# EAGLE design schematic (EAGLE 9.6.2)
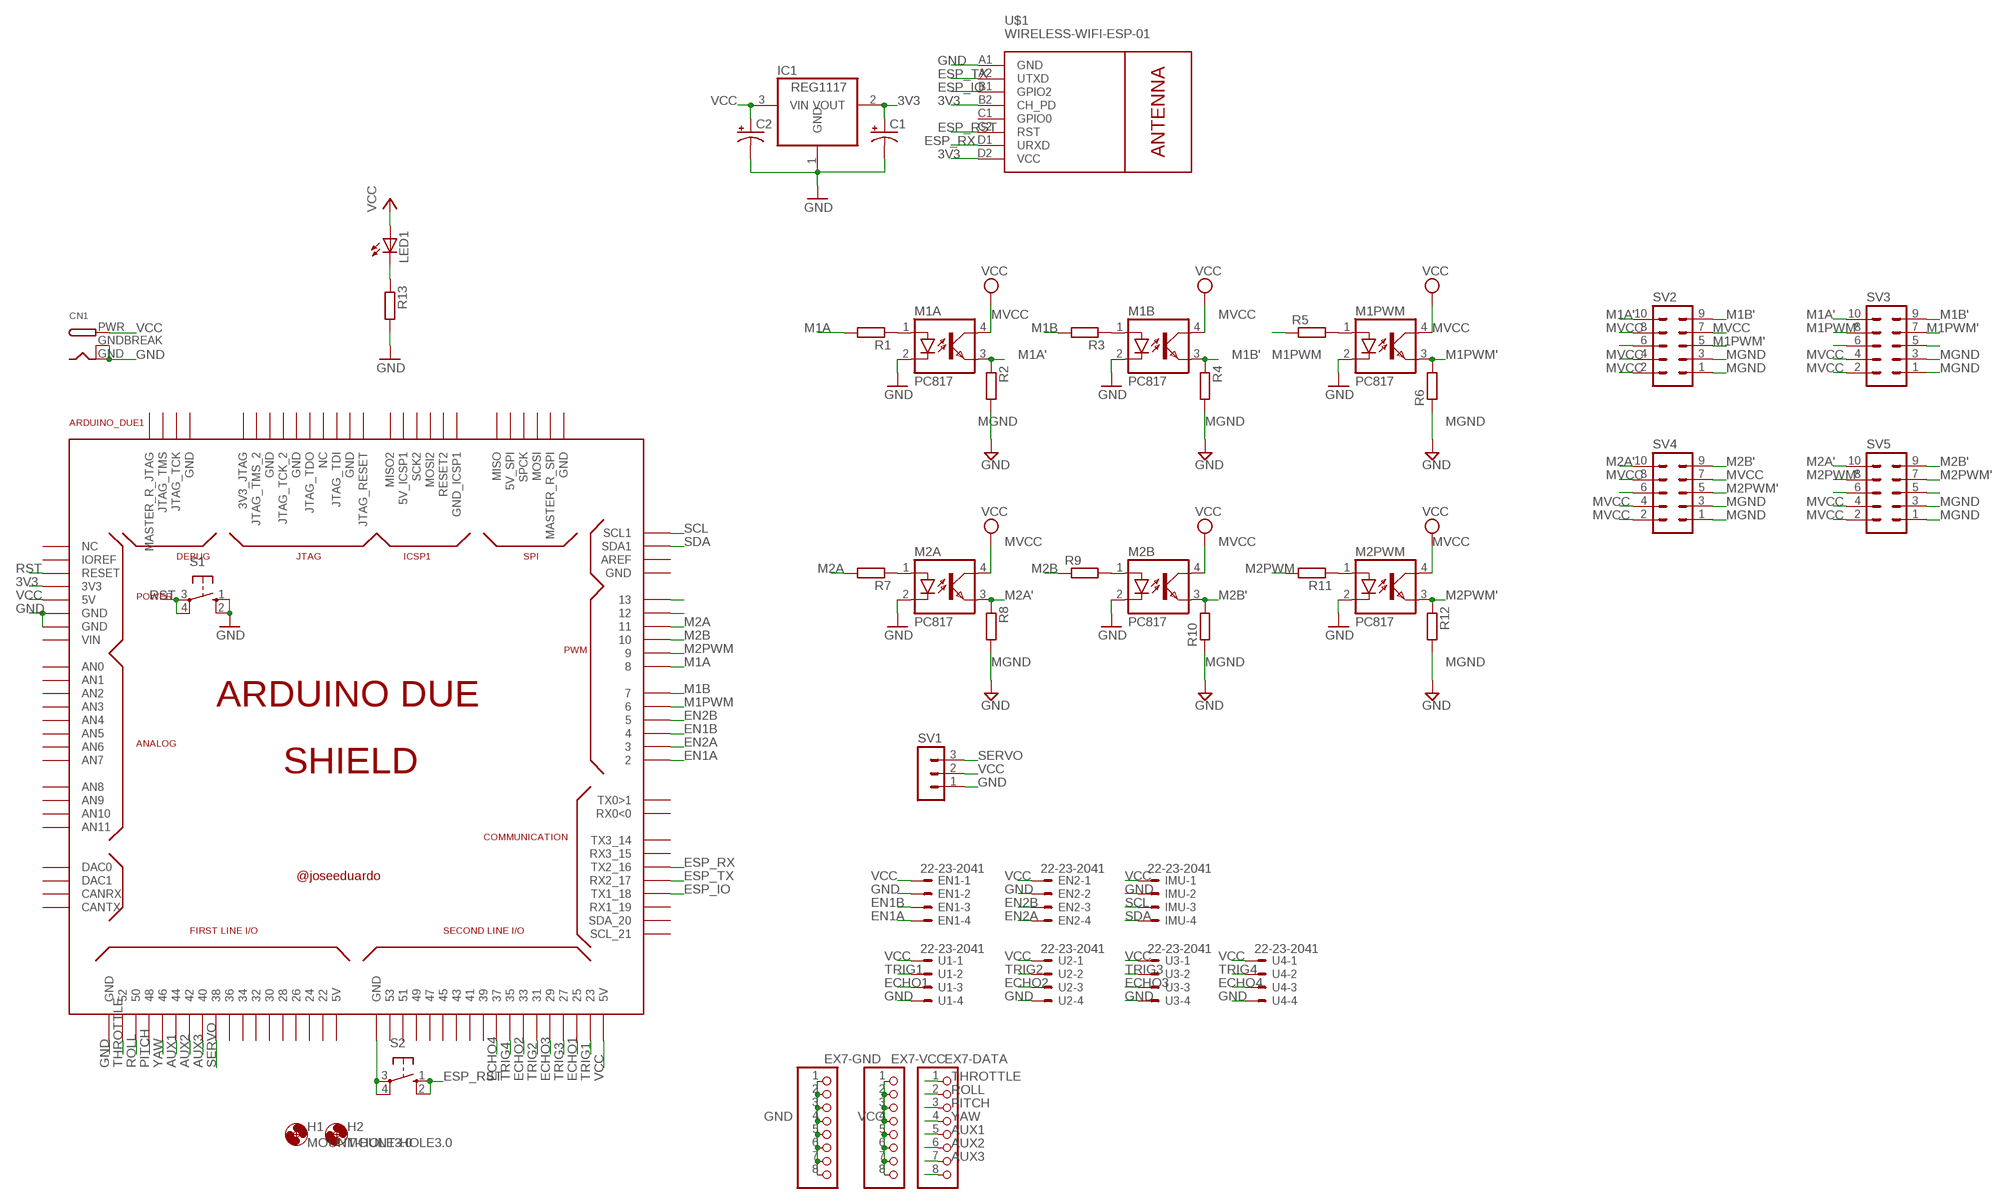
[diagram p0: schematic, sheet 1]

## Parts
ARDUINO_DUE1  ARDUINO_DUE_SHIELD  [ARDUINO_DUE_SHIELD]
C1  CPOL-USTT2D4  [TT2D4]
C2  CPOL-USTT2D4  [TT2D4]
CN1  DCBARRELPTH  [DCJACK_2MM_PTH]
EN1  22-23-2041  [22-23-2041]
EN2  22-23-2041  [22-23-2041]
EX7-DATA  PINHD-1X8BIG  [1X08-BIG]
EX7-GND  PINHD-1X8BIG  [1X08-BIG]
EX7-VCC  PINHD-1X8BIG  [1X08-BIG]
H1  MOUNT-HOLE3.0  [3,0]
H2  MOUNT-HOLE3.0  [3,0]
IC1  REG1117  [SOT223]
IMU  22-23-2041  [22-23-2041]
LED1  LED5MM  [LED5MM]
M1A  PC817  [DIL04]
M1B  PC817  [DIL04]
M1PWM  PC817  [DIL04]
M2A  PC817  [DIL04]
M2B  PC817  [DIL04]
M2PWM  PC817  [DIL04]
R1  R-EU_M0805  [M0805]
R2  R-EU_M0805  [M0805]
R3  R-EU_M0805  [M0805]
R4  R-EU_M0805  [M0805]
R5  R-EU_M0805  [M0805]
R6  R-EU_M0805  [M0805]
R7  R-EU_M0805  [M0805]
R8  R-EU_M0805  [M0805]
R9  R-EU_M0805  [M0805]
R10  R-EU_M0805  [M0805]
R11  R-EU_M0805  [M0805]
R12  R-EU_M0805  [M0805]
R13  R-EU_M0805  [M0805]
S1  40-XX  [B3F-40XX]
S2  40-XX  [B3F-40XX]
SV1  MA03-1  [MA03-1]
SV2  ML10  [ML10]
SV3  ML10  [ML10]
SV4  ML10  [ML10]
SV5  ML10  [ML10]
U1  22-23-2041  [22-23-2041]
U2  22-23-2041  [22-23-2041]
U3  22-23-2041  [22-23-2041]
U4  22-23-2041  [22-23-2041]
U$1  WIRELESS-WIFI-ESP-01  [WIRELESS-WIFI-ESP-01]

## Nets
3V3: ARDUINO_DUE1.3V3 C1.+ IC1.2(VOUT) U$1.B2(CH_PD) U$1.D2(VCC)
AUX1: ARDUINO_DUE1.44 EX7-DATA.5
AUX2: ARDUINO_DUE1.42 EX7-DATA.6
AUX3: ARDUINO_DUE1.40 EX7-DATA.7
ECHO1: ARDUINO_DUE1.25 U1.3
ECHO2: ARDUINO_DUE1.33 U2.3
ECHO3: ARDUINO_DUE1.29 U3.3
ECHO4: ARDUINO_DUE1.37 U4.3
EN1A: ARDUINO_DUE1.2 EN1.4
EN1B: ARDUINO_DUE1.4 EN1.3
EN2A: ARDUINO_DUE1.3 EN2.4
EN2B: ARDUINO_DUE1.5 EN2.3
ESP_IO: ARDUINO_DUE1.18(TX1_18) U$1.B1(GPIO2)
ESP_RST: S2.1(S) S2.2(S1) U$1.C2(RST)
ESP_RX: ARDUINO_DUE1.16(TX2_16) U$1.D1(URXD)
ESP_TX: ARDUINO_DUE1.17(RX2_17) U$1.A2(UTXD)
GND: ARDUINO_DUE1.GND ARDUINO_DUE1.GND_1(GND) ARDUINO_DUE1.GND_2(GND) C1.- C2.- CN1.GND CN1.GNDBREAK EN1.2 EN2.2 EX7-GND.1 EX7-GND.2 EX7-GND.3 EX7-GND.4 EX7-GND.5 EX7-GND.6 EX7-GND.7 EX7-GND.8 IC1.1(GND) IMU.2 M1A.2(C) M1B.2(C) M1PWM.2(C) M2A.2(C) M2B.2(C) M2PWM.2(C) R13.2 S1.1(S) S1.2(S1) SV1.1 U1.4 U2.4 U3.4 U4.4 U$1.A1(GND)
M1A: ARDUINO_DUE1.8 R1.2
M1A': M1A.3(EMIT) R2.1 SV2.10 SV3.10
M1B: ARDUINO_DUE1.7 R3.2
M1B': M1B.3(EMIT) R4.1 SV2.9 SV3.9
M1PWM: ARDUINO_DUE1.6 R5.1
M1PWM': M1PWM.3(EMIT) R6.2 SV2.5 SV3.7 SV3.8
M2A: ARDUINO_DUE1.11 R7.2
M2A': M2A.3(EMIT) R8.1 SV4.10 SV5.10
M2B: ARDUINO_DUE1.10 R9.1
M2B': M2B.3(EMIT) R10.2 SV4.9 SV5.9
M2PWM: ARDUINO_DUE1.9 R11.2
M2PWM': M2PWM.3(EMIT) R12.1 SV4.5 SV5.7 SV5.8
MGND: R2.2 R4.2 R6.1 R8.2 R10.1 R12.2 SV2.1 SV2.3 SV3.1 SV3.3 SV4.1 SV4.3 SV5.1 SV5.3 ; supply symbol labelled GND
MVCC: M1A.4(COL) M1B.4(COL) M1PWM.4(COL) M2A.4(COL) M2B.4(COL) M2PWM.4(COL) SV2.2 SV2.4 SV2.7 SV2.8 SV3.2 SV3.4 SV4.2 SV4.4 SV4.7 SV4.8 SV5.2 SV5.4 ; supply symbol labelled VCC
N$1: M1B.1(A) R3.1
N$2: M1A.1(A) R1.1
N$5: M1PWM.1(A) R5.2
N$6: SV2.6
N$7: M2A.1(A) R7.1
N$8: ARDUINO_DUE1.GND_3(GND) S2.3(P) S2.4(P1)
N$9: M2B.1(A) R9.2
N$10: EX7-DATA.8
N$11: M2PWM.1(A) R11.1
N$13: LED1.K(C) R13.1
N$16: ARDUINO_DUE1.12
N$21: ARDUINO_DUE1.13
N$23: SV3.6
N$28: SV3.5
N$33: SV4.6
N$42: SV5.6
N$48: SV5.5
PITCH: ARDUINO_DUE1.48 EX7-DATA.3
ROLL: ARDUINO_DUE1.50 EX7-DATA.2
RST: ARDUINO_DUE1.RESET S1.3(P) S1.4(P1)
SCL: ARDUINO_DUE1.SCL1 IMU.3
SDA: ARDUINO_DUE1.SDA1 IMU.4
SERVO: ARDUINO_DUE1.38 SV1.3
THROTTLE: ARDUINO_DUE1.52 EX7-DATA.1
TRIG1: ARDUINO_DUE1.23 U1.2
TRIG2: ARDUINO_DUE1.31 U2.2
TRIG3: ARDUINO_DUE1.27 U3.2
TRIG4: ARDUINO_DUE1.35 U4.2
VCC: ARDUINO_DUE1.5V0(5V) ARDUINO_DUE1.5V0_2(5V) C2.+ CN1.PWR EN1.1 EN2.1 EX7-VCC.1 EX7-VCC.2 EX7-VCC.3 EX7-VCC.4 EX7-VCC.5 EX7-VCC.6 EX7-VCC.7 EX7-VCC.8 IC1.3(VIN) IMU.1 LED1.A SV1.2 U1.1 U2.1 U3.1 U4.1
YAW: ARDUINO_DUE1.46 EX7-DATA.4
Unconnected: ARDUINO_DUE1.0(RX0<0) ARDUINO_DUE1.1(TX0>1) ARDUINO_DUE1.3V3_JTAG ARDUINO_DUE1.5V0_1(5V) ARDUINO_DUE1.5V_2(5V_SPI) ARDUINO_DUE1.5V_ICSP1 ARDUINO_DUE1.14(TX3_14) ARDUINO_DUE1.15(RX3_15) ARDUINO_DUE1.19(RX1_19) ARDUINO_DUE1.20(SDA_20) ARDUINO_DUE1.21(SCL_21) ARDUINO_DUE1.22 ARDUINO_DUE1.24 ARDUINO_DUE1.26 ARDUINO_DUE1.28 ARDUINO_DUE1.30 ARDUINO_DUE1.32 ARDUINO_DUE1.34 ARDUINO_DUE1.36 ARDUINO_DUE1.39 ARDUINO_DUE1.41 ARDUINO_DUE1.43 ARDUINO_DUE1.45 ARDUINO_DUE1.47 ARDUINO_DUE1.49 ARDUINO_DUE1.51 ARDUINO_DUE1.53 ARDUINO_DUE1.A0(AN0) ARDUINO_DUE1.A1(AN1) ARDUINO_DUE1.A2(AN2) ARDUINO_DUE1.A3(AN3) ARDUINO_DUE1.A4(AN4) ARDUINO_DUE1.A5(AN5) ARDUINO_DUE1.A6(AN6) ARDUINO_DUE1.A7(AN7) ARDUINO_DUE1.A8(AN8) ARDUINO_DUE1.A9(AN9) ARDUINO_DUE1.A10(AN10) ARDUINO_DUE1.A11(AN11) ARDUINO_DUE1.AREF ARDUINO_DUE1.CANRX ARDUINO_DUE1.CANTX ARDUINO_DUE1.DAC0 ARDUINO_DUE1.DAC1 ARDUINO_DUE1.GND_4(GND) ARDUINO_DUE1.GND_5(GND) ARDUINO_DUE1.GND_7(GND) ARDUINO_DUE1.GND_8(GND) ARDUINO_DUE1.GND_9(GND) ARDUINO_DUE1.GND_10(GND) ARDUINO_DUE1.GND_ICSP1 ARDUINO_DUE1.IOREF ARDUINO_DUE1.JTAG_RESET ARDUINO_DUE1.JTAG_TCK ARDUINO_DUE1.JTAG_TCK_2 ARDUINO_DUE1.JTAG_TDI ARDUINO_DUE1.JTAG_TDO ARDUINO_DUE1.JTAG_TMS ARDUINO_DUE1.JTAG_TMS_2 ARDUINO_DUE1.MASTER_RESET_JTAG(MASTER_R_JTAG) ARDUINO_DUE1.MASTER_RESET_SPI(MASTER_R_SPI) ARDUINO_DUE1.MISO ARDUINO_DUE1.MISO2 ARDUINO_DUE1.MOSI ARDUINO_DUE1.MOSI2 ARDUINO_DUE1.NC_2(NC) ARDUINO_DUE1.NC_5(NC) ARDUINO_DUE1.RESET2 ARDUINO_DUE1.SCK2 ARDUINO_DUE1.SPCK ARDUINO_DUE1.VIN U$1.C1(GPIO0)

## Library data of the parts
ARDUINO_DUE1 = arduino_due_shield:ARDUINO_DUE_SHIELD
C1 C2 = adafruit:CPOL-US: POLARIZED CAPACITOR, American symbol
CN1 = adafruit:DCBARREL: 2.0mm DC Barrel Jack DCJACK_2MM_PTH - Through Hole Jack (4UConnector: 05537)
EN1 EN2 IMU U1-U4 = con-molex:22-23-2041: .100" (2.54mm) Center Header - 4 Pin; MF: MOLEX; MPN: 22-23-2041; OC_FARNELL: 1462920; OC_NEWARK: 38C0355
EX7-DATA EX7-GND EX7-VCC = adafruit:PINHD-1X8: PIN HEADER
H1 H2 = holes:MOUNT-HOLE: MOUNTING HOLE with drill center marker
IC1 = burr-brown:REG1117: 800mA and 1A Low Dropout (LDO) Positive Regulator 1.8V, 2.5V, 2.85V, 3.3V, 5V, and Adj; MPN: REG1117; OC_FARNELL: 1097566; OC_NEWARK: 14P6981
LED1 = adafruit:LED: LED OSRAM: - CHIPLED LG R971, LG N971, LY N971, LG Q971, LY Q971, LO R971, LY R971 LH N974, LH R974 LS Q976, LO Q976, LY Q976 LO Q996 - Hyper CHIPLED LW Q18S LB Q993, LB Q99A, LB R99A - SideLED LS A670, LO A670, LY A670, LG A670, LP A670 LB A673, LV A673, LT A673, LW A673 LH A674 LY A675 LS A676, LA A676, LO A676, LY A676, LW A676 LS A679, LY A679, LG A679 - Hyper Micro SIDELED® LS Y876, LA Y876, LO Y876, LY Y876 LT Y87S - SmartLED LW L88C, LW L88S LB L89C, LB L89S, LG L890 LS L89K, LO L89K, LY L89K LS L896, LA L896, LO L896, LY L896 - TOPLED LS T670, LO T670, LY T670, LG T670, LP T670 LSG T670, LSP T670, LSY T670, LOP T670, LYG T670 LG T671, LOG T671, LSG T671 LB T673, LV T673, LT T673, LW T673 LH T674 LS T676, LA T676, LO T676, LY T676, LB T676, LH T676, LSB T676, LW T676 LB T67C, LV T67C, LT T67C, LS T67K, LO T67K, LY T67K, LW E67C LS E67B, LA E67B, LO E67B, LY E67B, LB E67C, LV E67C, LT E67C LW T67C LS T679, LY T679, LG T679 LS T770, LO T770, LY T770, LG T770, LP T770 LB T773, LV T773, LT T773, LW T773 LH T774 LS E675, LA E675, LY E675, LS T675 LS T776, LA T776, LO T776, LY T776, LB T776 LHGB T686 LT T68C, LB T68C - Hyper Mini TOPLED® LB M676 - Mini TOPLED Santana® LG M470 LS M47K, LO M47K, LY M47K Source: http://www.osram.convergy.de/
M1A M1B M1PWM M2A M2B M2PWM = optocoupler:PC817: SHARP OPTO COUPLER; MPN: PC817X4J000F; OC_FARNELL: 9707727; OC_NEWARK: 97K7059
R1-R13 = rcl:R-EU_: RESISTOR, European symbol; SPICEPREFIX: R
S1 S2 = adafruit:40-XX: OMRON SWITCH; MF: OMRON COMPONENTS USA; MPN: B3F-4000; OC_FARNELL: 176434; OC_NEWARK: 36K3105
SV1 = con-lstb:MA03-1: PIN HEADER; OC_FARNELL: unknown; OC_NEWARK: unknown
SV2-SV5 = con-ml:ML10: HARTING; OC_FARNELL: unknown; OC_NEWARK: unknown
U$1 = ESP-01:WIRELESS-WIFI-ESP-01: Wireless Wi-Fi ESP-01 Module based on ESP8266 chip Click here to find device on ebay.com <http://www.ebay.com/sch/esp8266+esp+01+transceiver>

## Board
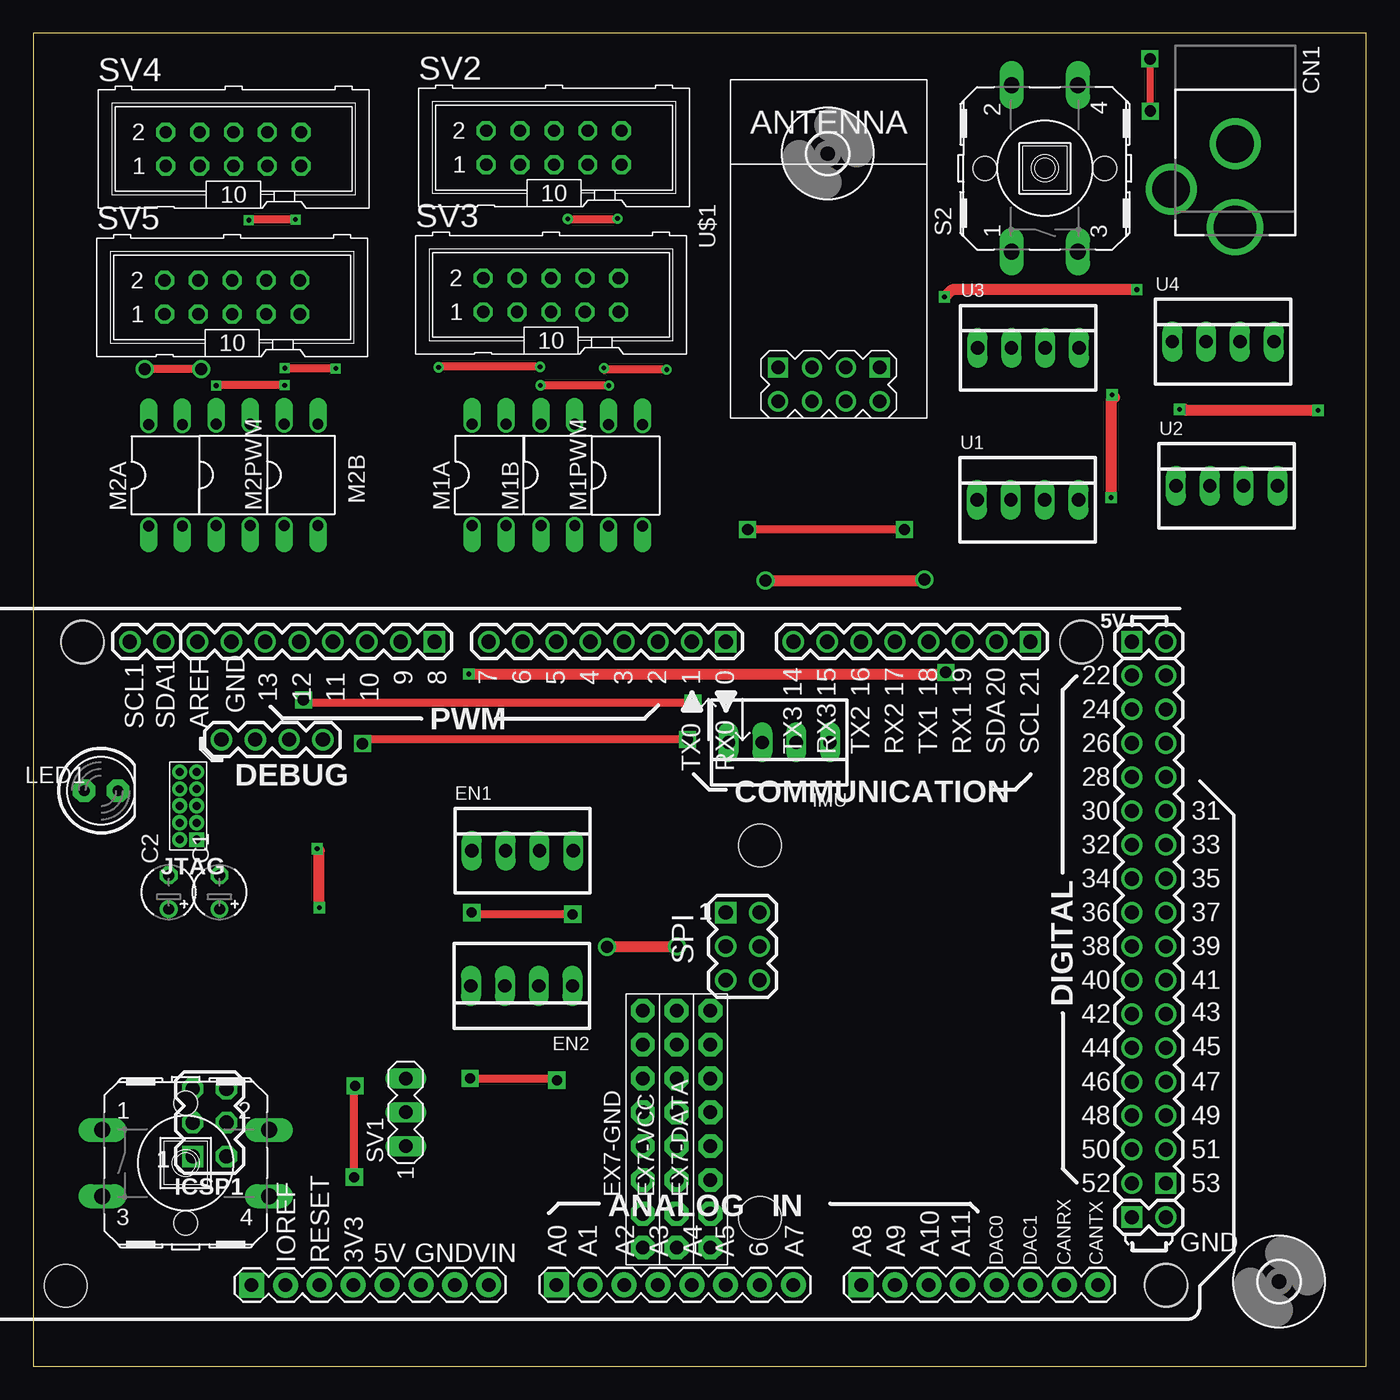
[diagram p1: board, top side]
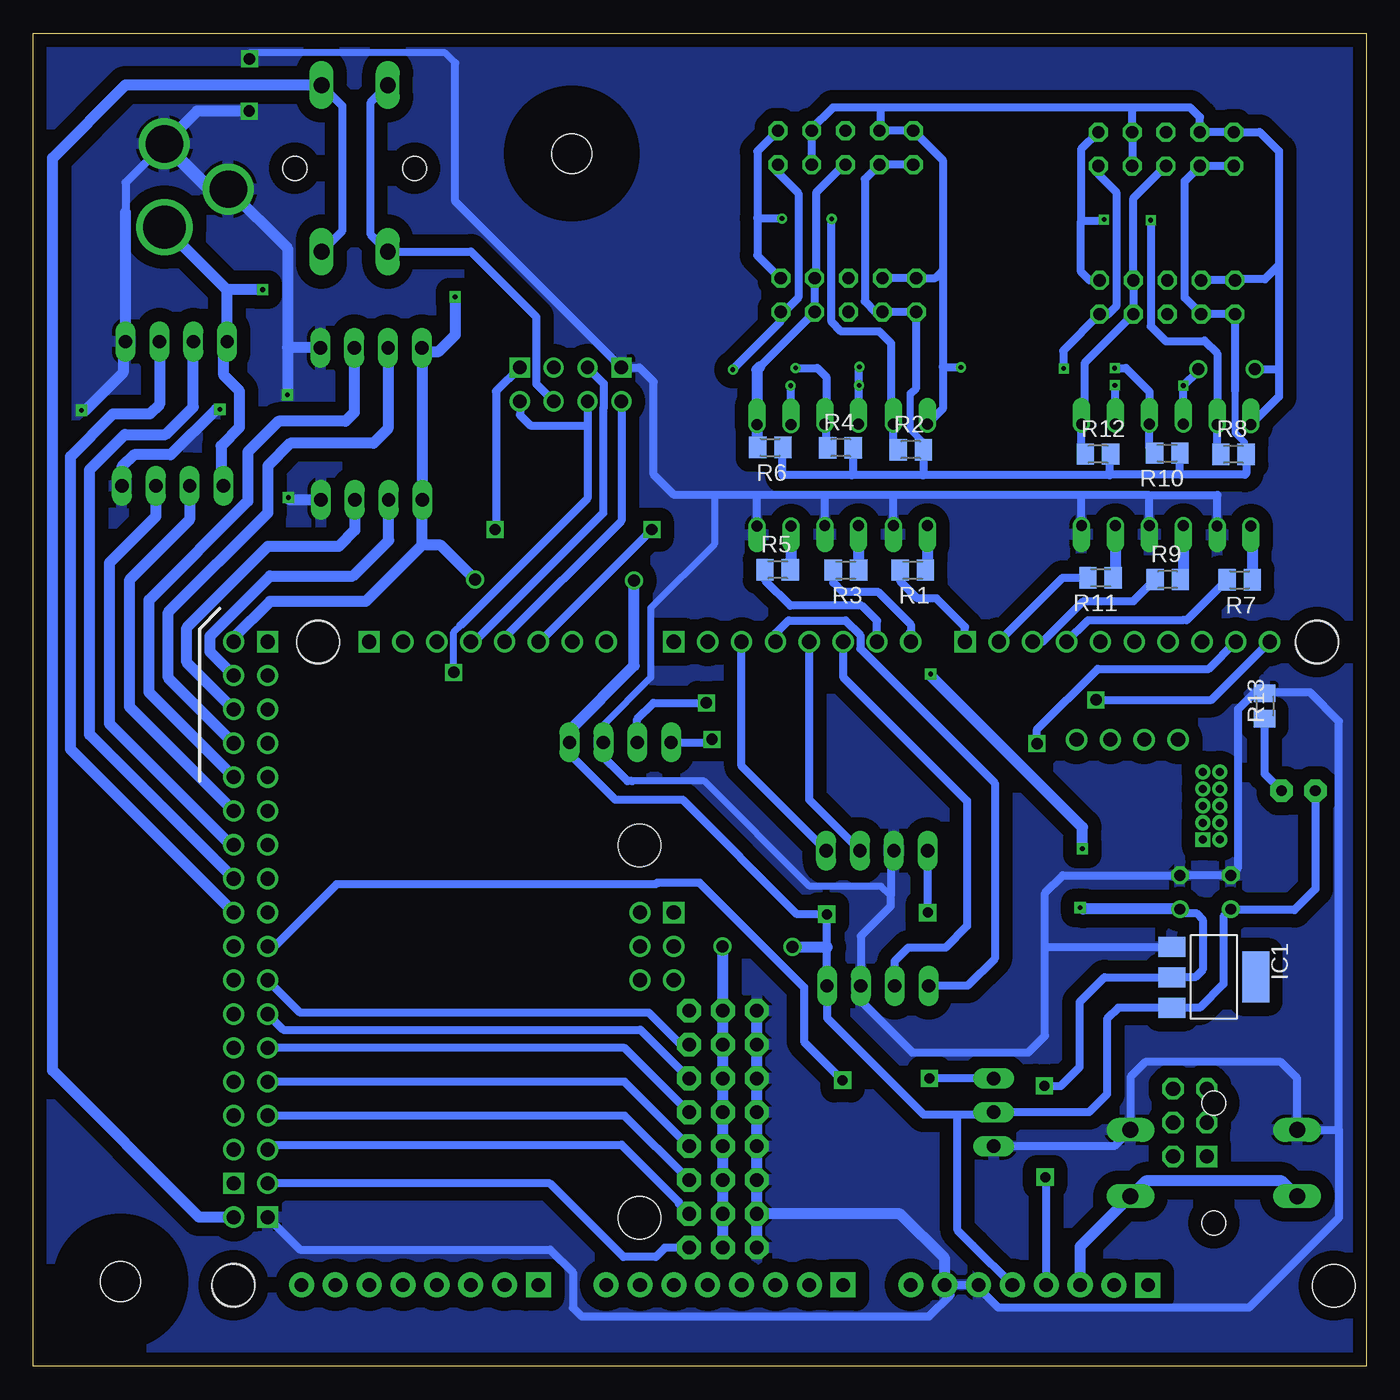
[diagram p2: board, bottom side, seen from below]

Size 100 x 100 mm. Coordinates in mm from the lower left corner, seen from the top.
Outline: 0,0 100,0 100,100 0,100 0,0
Copper layers (1*16): Top 0.035mm / dielectric 1.5mm / Bottom 0.035mm
Design rules "default": minimum track width 6mil, minimum drill 0.35mm, track to track 6mil, track to pad 6mil, pad to pad 6mil, via to via 6mil, smd to smd 6mil, copper to edge 40mil, drill to drill 6mil, minimum pad ring 10mil, minimum via ring 8mil, stop-mask expansion 4mil, vias tented up to drill 0mil, thermal gap 10mil

### Footprints (pad centres in the part's own frame; a part is rotated, then mirrored left to right if it is on the bottom)
ARDUINO_DUE_SHIELD = drill 1.067 square: 0 63.373,51.816; 5V0_1 93.853,51.816; 8 41.529,51.816; 21 86.233,51.816; 53 96.393,11.176; GND_2 93.853,8.636; MISO 63.373,31.496; MISO2 23.384,13.196 | drill 1.067: 1 60.833,51.816; 2 58.293,51.816; 3 55.753,51.816; 4 53.213,51.816; 5 50.673,51.816; 5V0_2 96.393,51.816; 5V_2 65.913,31.496; 6 48.133,51.816; 7 45.593,51.816; 9 38.989,51.816; 10 36.449,51.816; 11 33.909,51.816; 12 31.369,51.816; 13 28.829,51.816; 14 68.453,51.816; 15 70.993,51.816; 16 73.533,51.816; 17 76.073,51.816; 18 78.613,51.816; 19 81.153,51.816; 20 83.693,51.816; 22 93.853,49.276; 23 96.393,49.276; 24 93.853,46.736; 25 96.393,46.736; 26 93.853,44.196; 27 96.393,44.196; 28 93.853,41.656; 29 96.393,41.656; 30 93.853,39.116; 31 96.393,39.116; 32 93.853,36.576; 33 96.393,36.576; 34 93.853,34.036; 35 96.393,34.036; 36 93.853,31.496; 37 96.393,31.496; 38 93.853,28.956; 39 96.393,28.956; 40 93.853,26.416; 41 96.393,26.416; 42 93.853,23.876; 43 96.393,23.876; 44 93.853,21.336; 45 96.393,21.336; 46 93.853,18.796; 47 96.393,18.796; 48 93.853,16.256; 49 96.393,16.256; 50 93.853,13.716; 51 96.393,13.716; 52 93.853,11.176; AREF 23.749,51.816; GND_3 96.393,8.636; GND_4 26.289,51.816; GND_5 65.913,26.416; GND_7 33.161,44.473; JTAG_TCK 30.621,44.473; JTAG_TMS 28.081,44.473; MASTER_RESET_JTAG 25.541,44.473; MASTER_RESET_SPI 63.373,26.416; MOSI 65.913,28.956; SCL1 18.669,51.816; SDA1 21.209,51.816; SPCK 63.373,28.956 | drill 1.016 pad 1.88: 3V3 35.433,3.556; 5V0 37.973,3.556; A1 53.213,3.556; A2 55.753,3.556; A3 58.293,3.556; A4 60.833,3.556; A5 63.373,3.556; A6 65.913,3.556; A7 68.453,3.556; A9 76.073,3.556; A10 78.613,3.556; A11 81.153,3.556; CANRX 88.773,3.556; CANTX 91.313,3.556; DAC0 83.693,3.556; DAC1 86.233,3.556; GND 40.513,3.556; GND_1 43.053,3.556; IOREF 30.346,3.543; RESET 32.893,3.555; VIN 45.593,3.556 | drill 0.6 pad 1.016 square: 3V3_JTAG 23.689,36.964 | drill 1.067 octagon: 5V_ICSP1 25.924,13.196; GND_ICSP1 25.924,18.276; MOSI2 25.924,15.736; RESET2 23.384,18.276; SCK2 23.384,15.736 | drill 1.016 pad 1.88 square: A0 50.673,3.556; A8 73.533,3.556; NC_2 27.806,3.543 | drill 0.6 pad 1.143: GND_8 23.689,38.234; GND_9 23.689,40.774; GND_10 23.689,42.044; JTAG_RESET 22.419,42.044; JTAG_TCK_2 22.419,38.234; JTAG_TDI 22.419,40.774; JTAG_TDO 22.419,39.504; JTAG_TMS_2 22.419,36.964; NC_5 23.689,39.504 | hole 3.2: 15.113,51.816; 90.043,51.816; 96.393,3.556; 96.418,3.505; 15.138,51.765; 90.068,51.765; 13.868,3.505; 65.938,36.525; 65.938,8.585
TT2D4 = drill 0.813: + -1.27,0 | drill 0.813 octagon: - 1.27,0
DCJACK_2MM_PTH = drill 2.8: GND 0,7.35; GNDBREAK 4.8,10.75 | drill 3.2: PWR 0,13.6
22-23-2041 = drill 1 long: 1 -3.81,0; 2 -1.27,0; 3 1.27,0; 4 3.81,0
1X08-BIG = drill 1.016 pad 1.778 octagon: 1 -8.89,0; 2 -6.35,0; 3 -3.81,0; 4 -1.27,0; 5 1.27,0; 6 3.81,0; 7 6.35,0; 8 8.89,0
3,0 = hole 3: 0,0
SOT223 = smd 1.499 x 2.007: 1 -2.261,-3.15; 2 0.025,-3.15; 3 2.311,-3.15 | smd 3.81 x 2.007: 4 0,3.15
LED5MM = drill 0.813 pad 1.676 octagon: A -1.27,0; K 1.27,0
DIL04 = drill 0.813 offset: 1 -1.27,-3.81; 2 1.27,-3.81; 3 1.27,3.81; 4 -1.27,3.81
M0805 = smd 1.3 x 1.6: 1 -0.95,0; 2 0.95,0
B3F-40XX = drill 1.194 long: 1 -6.248,2.489; 2 6.248,2.489; 3 -6.248,-2.489; 4 6.248,-2.489 | hole 1.803: 0,-4.496; 0,4.496
MA03-1 = drill 1.016 long: 1 -2.54,0; 2 0,0; 3 2.54,0
ML10 = drill 0.914 octagon: 1 -5.08,-1.27; 2 -5.08,1.27; 3 -2.54,-1.27; 4 -2.54,1.27; 5 0,-1.27; 6 0,1.27; 7 2.54,-1.27; 8 2.54,1.27; 9 5.08,-1.27; 10 5.08,1.27
WIRELESS-WIFI-ESP-01 = drill 1 square: A1 -8.89,3.81; D1 -8.89,-3.81 | drill 1: A2 -11.43,3.81; B1 -8.89,1.27; B2 -11.43,1.27; C1 -8.89,-1.27; C2 -11.43,-1.27; D2 -11.43,-3.81

### Placement (x,y rotation side)
ARDUINO_DUE1  -11.43,2.54 0 top
C1  13.97,35.56 90 top
C2  10.16,35.56 90 top
CN1  90.17,99.06 180 top
EN1  36.71,38.68 0 top
EN2  36.65,28.53 180 top
EX7-DATA  50.8,17.78 90 top
EX7-GND  45.72,17.78 90 top
EX7-VCC  48.26,17.78 90 top
H1  93.46,6.35 0 top
H2  59.61,90.97 0 top
IC1  11.43,29.21 270 bottom
IMU  55.96,46.8 180 top
LED1  5.08,43.18 0 top
M1A  34.19,66.87 0 top
M1B  39.35,66.87 0 top
M1PWM  44.44,66.83 0 top
M2A  9.92,66.84 0 top
M2B  14.99,66.87 0 top
M2PWM  20.08,66.87 0 top
R1  34.02,59.73 180 bottom
R2  34.17,68.76 0 bottom
R3  39.04,59.73 180 bottom
R4  39.44,68.91 0 bottom
R5  44.15,59.75 0 bottom
R6  44.7,68.93 180 bottom
R7  9.5,58.99 180 bottom
R8  9.95,68.41 0 bottom
R9  14.9,59.02 0 bottom
R10  14.94,68.51 180 bottom
R11  19.93,59.16 180 bottom
R12  20.12,68.43 0 bottom
R13  7.62,49.53 90 bottom
S1  11.43,15.24 0 top
S2  75.89,89.87 90 top
SV1  27.94,19.05 90 top
SV2  39.06,91.42 0 top
SV3  38.84,80.37 0 top
SV4  15.02,91.32 0 top
SV5  14.92,80.19 0 top
U1  74.61,64.99 0 top
U2  89.54,66.04 0 top
U3  74.65,76.41 0 top
U4  89.27,76.87 0 top
U$1  59.69,83.82 90 top

### Tracks (layer width: path | path; a pad name or v marks a point on that pad's centre or on a via)
3V3  (via drill 0.35 pad 0.85, 0.75 pad 1.3, 0.85 pad 0.85)
  Top 0.61: v24.08,14.18 24.08,20.72 23.96,20.84 v24.14,21.02
  Top 0.813: v21.45,34.39 21.45,38.66 v21.29,38.82 | v21.29,38.82 | v32.68,51.93 68.56,51.93 68.57,51.95 v68.45,52.06
  Bottom 0.508: v68.45,52.06 68.45,55.08 67.96,55.57
  Bottom 0.61: C1.+ 13.67,33.99 12.76,33.99 12.26,33.49 12.26,29.75 12.82,29.18 IC1.2 19.63,29.18 21.5,27.32 21.5,22.44 22.91,21.02 v24.14,21.02 | U$1.D2 63.5,71.36 62.71,70.57 58.57,70.57 58.42,70.72 | ARDUINO_DUE1.3V3 24,14.1 v24.08,14.18 | 58.42,70.72 58.42,65.11 67.96,55.57 | U$1.B2 58.42,70.72
  Bottom 0.813: C1.+ 21.24,34.29 21.4,34.44 v21.45,34.39 | v21.29,38.82 21.29,40.44 32.68,51.83 v32.68,51.93
AUX1
  Bottom 0.61: EX7-DATA.5 55.63,23.88 ARDUINO_DUE1.44
AUX2
  Bottom 0.61: EX7-DATA.6 54.45,25.24 81.25,25.24 ARDUINO_DUE1.42
AUX3
  Bottom 0.61: EX7-DATA.7 51.44,24.13 53.82,26.51 79.98,26.51 ARDUINO_DUE1.40
ECHO1
  Bottom 0.813: ARDUINO_DUE1.25 88.49,52.81 88.49,55.42 82.4,61.51 77.09,61.51 75.88,62.72 U1.3
ECHO2
  Bottom 0.813: U2.3 90.81,63.76 94.3,60.27 94.3,48.22 85.2,39.12 ARDUINO_DUE1.33
ECHO3
  Bottom 0.813: ARDUINO_DUE1.29 91.31,50.54 91.31,57.49 83.92,64.89 83.92,68.58 81.61,70.89 76.58,70.89 75.92,71.55 U3.3
ECHO4
  Bottom 0.813: ARDUINO_DUE1.37 97.2,46.28 97.2,68.26 94.03,71.43 91.25,71.43 90.54,72.15 U4.3
EN1A
  Bottom 0.61: EN1.4 46.86,45.03 ARDUINO_DUE1.2
EN1B
  Bottom 0.61: EN1.3 41.78,42.49 ARDUINO_DUE1.4
EN2A
  Bottom 0.61: ARDUINO_DUE1.3 44.32,54.97 43.34,55.95 39.06,55.95 37.96,54.85 37.96,53.84 27.87,43.74 27.87,30.57 29.91,28.53 EN2.4
EN2B
  Bottom 0.61: ARDUINO_DUE1.5 39.24,51.72 29.94,42.42 29.94,33.01 31.57,31.39 34.37,31.39 35.38,30.39 EN2.3
ESP_IO
  Bottom 0.61: U$1.B1 57.21,73.72 57.21,71.89 57.24,71.86 57.24,64 66.89,54.36 ARDUINO_DUE1.18
ESP_RST
  Bottom 0.61: U$1.C2 62.27,73.7 62.27,78.74 67.16,83.62 S2.1 74.69,84.91 74.69,94.83 S2.2
ESP_RX  (via drill 0.85 pad 0.85)
  Top 0.61: v65.35,62.77 54.02,62.77 53.96,62.83 53.65,62.83 v53.59,62.77
  Bottom 0.61: U$1.D1 65.29,73.14 65.29,62.83 v65.35,62.77 | v53.59,62.77 62,54.36 ARDUINO_DUE1.16
ESP_TX
  Bottom 0.61: U$1.A2 55.88,63.42 64.64,54.65 ARDUINO_DUE1.17
GND  (via drill 0.35 pad 0.85, 0.85 pad 0.85)
  Top 0.508: v83.78,98.08 83.78,94.33 83.87,94.24 v83.81,94.17
  Top 0.813: v96.4,71.71 86.48,71.71 86.42,71.77 86.01,71.77 v85.99,71.78 | v80.88,65.17 80.88,72.45 81.12,72.69 | 81.12,72.69 | 81.12,72.69 v80.94,72.88
  Bottom 0.508: 48.91,65.36 48.91,61.65 53.67,56.88 53.67,51.66 57.23,48.1 IMU.2 | 35.66,35.27 36.4,36.01 41.75,36.01 49.65,43.9 55.07,43.9 | 68.34,88.64 68.34,97.79 69.09,98.53 83.78,98.53 v83.78,98.08
  Bottom 0.61: 7.99,50.48 8.44,50.48 9.6,49.32 9.6,37.39 C2.- C1.- 22.77,36.83 24.1,35.5 24.1,31.51 | 7.99,50.48 R13.2 | EN1.2 35.66,38.45 35.66,35.27 35.66,34.52 37.91,32.27 EN2.2 37.91,27.4 34.06,23.54 25.36,23.54 24.1,24.8 24.1,31.51 | SV1.1 18.9,16.51 S1.2 17.68,21.7 16.57,22.81 6.41,22.81 5.18,21.59 S1.1 2.04,17.73 | ARDUINO_DUE1.GND_1 31.19,6.1 | 31.19,6.1 ARDUINO_DUE1.GND 29.08,5.89 27.61,4.42 8.78,4.42 2.03,11.16 2.03,17.72 2.04,17.73 | 2.04,17.73 2.04,48.39 4.2,50.55 7.92,50.55 7.99,50.48 | IC1.1 24.06,31.47 24.1,31.51 | ARDUINO_DUE1.GND_2 80,8.75 61.21,8.75 59.51,7.04 59.51,4.38 58.87,3.73 32.79,3.73 31.19,5.33 31.19,6.1 | M2A.2 11.19,65.34 11.16,65.36 16.36,65.36 | 16.36,65.36 21.42,65.36 | 21.42,65.36 35.33,65.36 | 35.33,65.36 40.65,65.36 | 40.65,65.36 45.71,65.36 | M1PWM.2 45.71,65.36 | M2B.2 16.26,65.26 16.36,65.36 | M2PWM.2 21.35,65.3 21.42,65.36 | M1A.2 35.46,65.23 35.33,65.36 | M1B.2 40.62,65.34 40.65,65.36 | 45.71,65.36 48.91,65.36 51.93,65.36 53.47,66.9 53.47,73.87 54.53,74.93 U$1.A1 68.34,87.39 68.34,97.79 | CN1.GND 90.41,91.47 93.08,88.8 93.08,86.55 | 55.07,43.9 55.43,43.9 57.23,45.71 IMU.2
  Bottom 0.813: U2.4 93.35,67.48 92.45,68.39 89.7,68.39 86.3,71.78 v85.99,71.78 | v96.4,71.71 96.09,71.71 93.26,74.53 93.26,76.69 U4.4 93.08,86.55 | U1.4 80.76,64.99 80.88,65.11 v80.88,65.17 | CN1.GNDBREAK 80.94,83.88 80.94,76.46 | 80.94,76.46 v80.94,72.88 | U3.4 80.89,76.41 80.94,76.46 | v83.81,94.17 87.71,94.17 90.41,91.47 | EX7-GND.1 EX7-GND.2 | EX7-GND.2 EX7-GND.3 EX7-GND.4 EX7-GND.5 EX7-GND.6 EX7-GND.7 EX7-GND.8 | ARDUINO_DUE1.GND_1 31.62,8.09 34.97,11.43 EX7-GND.2
  Bottom 1.016: CN1.GND 86.77,88.31 CN1.GNDBREAK
  pour Bottom (isolate 1.016): 0,99.06 0,0 100.33,0 100.33,100.33 0,100.33
M1A
  Bottom 0.61: R1.2 34.97,58.92 33.65,57.6 32.23,57.6 30.1,55.47 ARDUINO_DUE1.8
M1A'  (via drill 0.35)
  Top 0.61: v40.1,86.07 43.78,86.07 43.81,86.1 v43.84,86.1
  Bottom 0.152: SV2.10 44.33,92.5
  Bottom 0.61: 45.68,86.16 45.68,91.16 44.33,92.5 | 45.68,86.16 45.68,83.33 43.99,81.64 SV3.10 | v43.84,86.1 45.62,86.1 45.68,86.16 | v40.1,86.07 40.12,86.06 40.12,78.36 39.39,77.63 36.52,77.63 35.63,76.73 35.63,70.85 M1A.3 35.46,69.09 R2.1
M1B
  Bottom 0.61: R3.2 39.99,58.78 39.32,58.11 36.64,58.11 34.16,55.63 34.16,54.94
  Bottom 0.813: 34.16,54.94 ARDUINO_DUE1.7
M1B'  (via drill 0.35)
  Top 0.61: v47.52,74.77 42.85,74.77 42.77,74.85 v42.81,74.89
  Bottom 0.152: 43.53,79.24 43.67,79.1 SV3.9
  Bottom 0.61: 43.53,79.24 42.6,80.17 42.6,87.99 44.14,89.54 SV2.9 | SV3.9 43.92,78.42 47.52,74.82 v47.52,74.77 | v42.81,74.89 41.19,74.89 40.5,74.21 40.5,70.8 | 40.5,70.8 M1B.3 | R4.1 40.5,69.02 40.5,70.8
M1PWM
  Bottom 0.61: R5.1 45.1,58.96 43.21,57.06 37.84,57.06 36.7,55.93 ARDUINO_DUE1.6
M1PWM'
  Bottom 0.152: 41.41,81.66 SV3.8 41.38,81.94
  Bottom 0.61: SV3.8 SV3.7 45.48,74.99 | SV2.5 39.16,90.16 41.28,88.04 41.28,82.05 41.38,81.94 | R6.2 45.71,68.98
  Bottom 0.813: 45.48,74.99 45.71,74.77 45.71,71.14 | 45.71,71.14 M1PWM.3 | R6.2 45.65,71.08 45.71,71.14
M2A
  Bottom 0.61: ARDUINO_DUE1.11 20.86,55.98 13.78,55.98 13.46,55.98 R7.2
M2A'  (via drill 0.35)
  Top 0.61: v19.68,86.03 16.17,86.03 v16.17,85.99
  Bottom 0.152: 20.04,81.47 SV5.10
  Bottom 0.61: SV4.10 21.4,91.29 21.4,85.9 | 21.4,85.9 21.4,82.11 20.76,81.47 20.04,81.47 | 21.4,85.9 21.36,85.94 19.74,85.94 19.68,86.01 v19.68,86.03 | v16.17,85.99 16.17,78.03 15.03,76.89 12.2,76.89 12.13,76.95 11.19,76 M2A.3 11.19,68.69 R8.1
M2B
  Bottom 0.61: R9.1 17.46,57.4 21.21,57.4 24.26,54.36 ARDUINO_DUE1.10
M2B'  (via drill 0.35)
  Top 0.61: v22.69,74.85 18.9,74.85 v18.86,74.89
  Bottom 0.152: 18.94,79.33 18.88,79.39
  Bottom 0.61: 18.88,79.39 18.75,79.53 18.75,88.08 20.1,89.44 SV4.9 | 18.94,79.33 19.35,78.92 SV5.9 22.74,76.19 22.74,74.82 22.69,74.82 v22.69,74.85 | v18.86,74.89 18.03,74.89 16.26,73.11 M2B.3 16.26,68.88 R10.2
M2PWM
  Bottom 0.61: ARDUINO_DUE1.9 22.76,59.16 R11.2
M2PWM'
  Bottom 0.61: SV4.5 15.06,90.05 17.46,87.64 SV5.8 SV5.7 21.13,75.26 21.13,70.9 M2PWM.3 21.35,68.7 R12.1
MGND
  Bottom 0.152: 36.39,79.1 SV3.3
  Bottom 0.508: R2.2 33.22,69.3 34.2,70.27 34.2,72.96 34.18,72.98 | 9.84,73.2 9.84,70.03 9.13,69.32 9.13,68.54 R8.2
  Bottom 0.61: R8.2 9,66.96 9.09,66.88 13.87,66.88 | R10.1 13.99,67 13.87,66.88 | 13.87,66.88 19.18,66.88 19.24,66.82 19.24,66.85 | 19.24,66.85 19.24,68.35 R12.2 | 19.24,66.85 33.27,66.85 | 33.27,66.85 33.25,66.82 33.22,66.85 R2.2 | 33.27,66.85 38.61,66.85 | 38.61,66.85 43.73,66.85 43.78,66.8 43.78,68.9 R6.1 | R4.2 38.49,66.96 38.61,66.85 | SV3.3 SV3.1 33.76,73.4 34.18,72.98 | SV2.1 SV2.3 37.61,89.07 37.61,79.9 36.8,79.1 36.39,79.1 | SV4.1 SV4.3 13.61,88.91 13.61,80.16 SV5.3 SV5.1 9.84,73.2
MVCC  (via drill 0.35, 0.9)
  Top 0.61: v43.18,73.56 38.1,73.56 38.06,73.61 v38.05,73.59 | v38.02,74.98 30.41,74.98 v30.41,74.94 | v18.86,73.59 13.87,73.59 13.81,73.66 v13.72,73.56 | v12.61,74.82 v8.36,74.82
  Bottom 0.152: SV4.2 9.57,92.58 | 31.77,82.24 31.77,82.2 31.83,82.13 | 32.33,81.64 34.11,81.64
  Bottom 0.61: SV3.4 34.11,81.64 SV3.2 32.33,81.64 31.83,82.13 | SV2.7 SV2.8 41.68,92.77 40.02,94.43 36.39,94.43 | SV4.8 SV4.7 | SV5.4 SV5.2 9.76,81.55 7.6,81.55 6.55,82.6 | 17.65,92.67 SV4.8 | 6.55,82.6 6.55,91.16 7.98,92.58 SV4.2 SV4.4 12.48,93.71 13.2,94.43 17.4,94.43 | 6.55,82.6 6.55,74.82 | 6.55,74.82 6.55,72.74 M2A.4 | 31.77,74.98 31.77,82.24 31.77,90.48 SV2.2 SV2.4 36.39,92.83 36.39,94.43 | 31.77,74.98 31.77,71.83 M1A.4 | M1B.4 38.08,73.59 v38.05,73.59 38.05,74.83 38.06,74.85 38.06,74.94 v38.02,74.98 | M1PWM.4 43.17,73.52 43.15,73.54 v43.18,73.56 | v30.41,74.94 31.73,74.94 31.77,74.98 | 17.4,94.43 36.39,94.43 | SV4.8 17.56,94.27 17.4,94.43 | M2PWM.4 18.81,73.37 18.86,73.42 v18.86,73.59 | M2B.4 v13.72,73.56 12.61,74.67 v12.61,74.82 | v8.36,74.82 6.55,74.82
N$1
  Bottom 0.813: M1B.1 38.08,60.03 38.09,60.02 R3.1
N$2
  Bottom 0.813: M1A.1 32.92,59.9 33.07,59.75 R1.1
N$5
  Bottom 0.813: M1PWM.1 43.17,60.49 R5.2
N$7
  Bottom 0.813: M2A.1 8.56,62.95 8.56,59 R7.1
N$8
  Bottom 0.61: S2.4 76.8,94.53 76.8,85.2 S2.3
  Bottom 0.813: 78.32,96.06 S2.4 93.09,96.12 98.56,90.65 98.56,22.18 87.56,11.18 ARDUINO_DUE1.GND_3
N$9
  Bottom 0.813: M2B.1 13.72,59.24 R9.2
N$11
  Bottom 0.813: M2PWM.1 18.81,59.32 R11.1
N$13
  Bottom 0.61: LED1.K 7.62,44.45 R13.1
PITCH
  Bottom 0.61: EX7-DATA.3 55.63,18.8 ARDUINO_DUE1.48
ROLL
  Bottom 0.61: EX7-DATA.2 51.59,12.22 51.59,12.34 55.86,16.61 82.07,16.61 ARDUINO_DUE1.50
RST
  Bottom 0.813: S1.3 6.33,13.89 16.54,13.89 S1.4 21.46,8.97 ARDUINO_DUE1.RESET
SCL  (via drill 0.85 pad 0.85)
  Top 0.61: v49.5,49.77 20.4,49.77 20.23,49.95 v20.27,49.99
  Bottom 0.61: IMU.3 54.69,48.55 53.47,49.77 v49.5,49.77 | v20.27,49.99 11.6,49.99 ARDUINO_DUE1.SCL1
SDA  (via drill 0.85 pad 0.85)
  Top 0.61: v49.08,47.03 24.8,47.03 24.59,46.81 v24.7,46.71
  Bottom 0.61: IMU.4 48.88,46.8 48.86,46.81 v49.08,47.03 | v24.7,46.71 24.7,47.78 20.15,52.33 11.81,52.33 ARDUINO_DUE1.SDA1
SERVO  (via drill 0.75 pad 1.3)
  Top 0.61: v32.77,21.6 38.96,21.6 39.05,21.68 v39.28,21.45
  Bottom 0.61: SV1.3 v32.77,21.59 v32.77,21.6 | v39.28,21.45 42.17,24.34 42.17,28.43 50.01,36.27 53.17,36.27 53.3,36.14 77.25,36.14 81.89,31.5 ARDUINO_DUE1.38
THROTTLE
  Bottom 0.61: EX7-DATA.1 52.61,8.89 53.3,8.2 55.72,8.2 61.23,13.72 ARDUINO_DUE1.52
TRIG1
  Bottom 0.813: U1.2 73.34,61.96 76.02,59.28 82.23,59.28 86.74,54.78 86.74,53.59 ARDUINO_DUE1.23
TRIG2
  Bottom 0.813: ARDUINO_DUE1.31 92.8,49.49 92.8,58.97 88.27,63.5 U2.2
TRIG3
  Bottom 0.813: ARDUINO_DUE1.27 89.86,51.64 89.86,56.56 82.42,64.01 82.42,67.54 80.71,69.24 74.47,69.24 73.38,70.33 U3.2
TRIG4
  Bottom 0.813: ARDUINO_DUE1.35 95.78,47.39 95.78,67.25 93.13,69.9 90.07,69.9 88,71.97 U4.2
VCC  (via drill 0.35 pad 0.85, 0.75 pad 1.3, 0.9)
  Top 0.61: v32.89,34.03 33.02,33.91 v40.47,33.91
  Top 0.813: v82.8,80.77 | v82.8,80.77 68.9,80.77 v68.35,80.21 | v48.28,31.51 48.24,31.46 v43.05,31.46 | v54.92,58.94 66.78,58.94 v66.87,59.03
  Bottom 0.61: LED1.A 3.81,35.79 5.39,34.21 10.08,34.21 C2.+ 10.71,33.74 10.71,28.68 12.49,26.9 IC1.3 18.6,26.9 19.45,26.05 19.45,20.39 20.8,19.05 SV1.2 28.11,18.88 30.65,18.88 | v32.89,34.03 EN1.1 | 30.65,18.88 33.22,18.88 40.45,26.11 EN2.1 40.45,31.42 40.45,33.53 40.47,33.54 v40.47,33.91 42.69,33.91 51.26,42.48 56.33,42.48 59.97,46.12 59.97,46.8 IMU.1 | ARDUINO_DUE1.5V0 29.5,9.05 30.65,10.2 30.65,18.88
  Bottom 0.813: 70.84,65.03 U3.1 70.52,76.08 69.64,76.08 68.35,77.37 v68.35,80.21 | 70.84,65.03 U1.1 | U2.1 85.92,66.23 85.92,69.05 84.52,70.44 84.52,73.15 85.71,74.34 85.71,77.13 U4.1 85.46,80.75 85.48,80.77 | v82.8,80.77 85.48,80.77 | 85.48,80.77 CN1.PWR | ARDUINO_DUE1.5V0_2 84.96,54.65 82.24,57.38 75.06,57.38 70.84,61.59 | EX7-VCC.1 EX7-VCC.2 EX7-VCC.3 EX7-VCC.4 EX7-VCC.5 EX7-VCC.6 EX7-VCC.7 EX7-VCC.8 48.26,31.49 v48.28,31.51 | v43.05,31.46 40.5,31.46 40.45,31.42 | 70.84,61.59 70.84,65.03 | IMU.1 59.77,47.7 54.92,52.56 v54.92,58.94 | v66.87,59.03 69.44,61.59 70.84,61.59
YAW
  Bottom 0.61: EX7-DATA.4 55.63,21.34 ARDUINO_DUE1.46